# Altium schematic sheet Boost.SchDoc
size A4; SheetNumber: 3; SheetTotal: 4
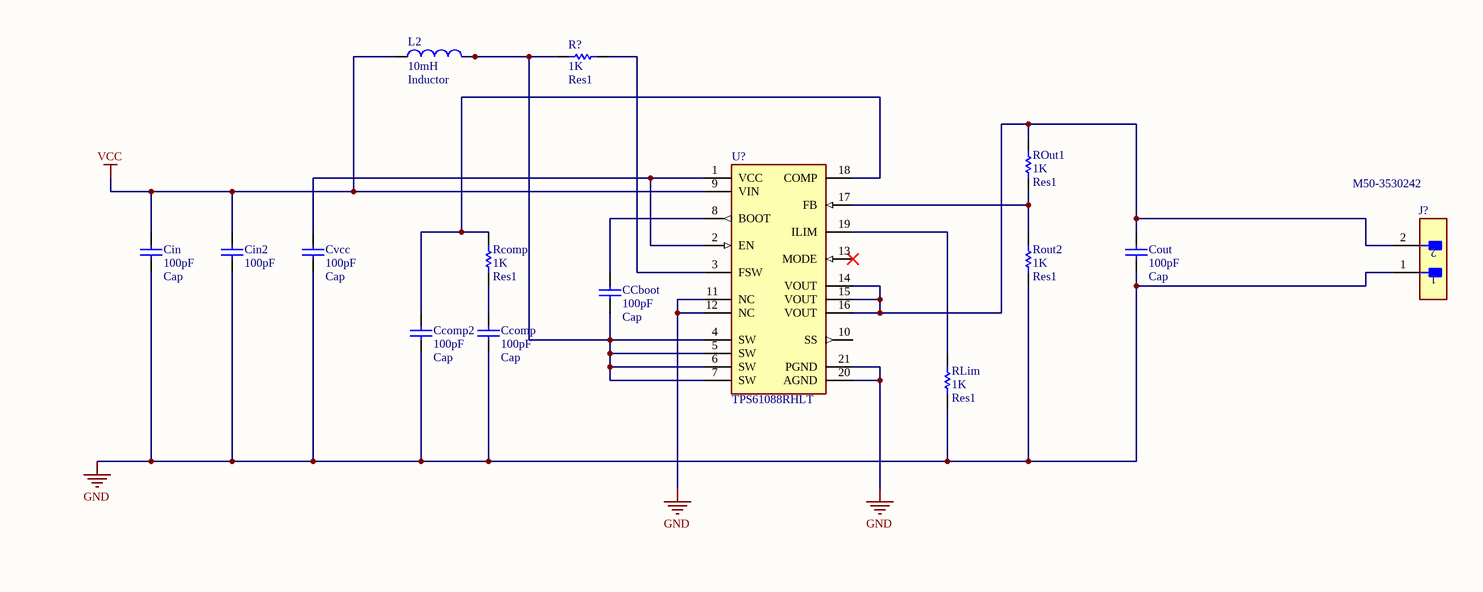
[diagram p0: Boost.SchDoc, right]

## Parts
CCboot  Cap  value 100pF  [RAD-0.3]
Ccomp  Cap  value 100pF  [RAD-0.3]
Ccomp2  Cap  value 100pF  [RAD-0.3]
Cin  Cap  value 100pF  [RAD-0.3]
Cin2  value 100pF  [RAD-0.3]
Cout  Cap  value 100pF  [RAD-0.3]
Cvcc  Cap  value 100pF  [RAD-0.3]
J?  M50-3530242  [FP-M50-3530242-MFG]
L2  Inductor  value 10mH  [0402-A]
R?  Res1  value 1K  [AXIAL-0.3]
Rcomp  Res1  value 1K  [AXIAL-0.3]
RLim  Res1  value 1K  [AXIAL-0.3]
ROut1  Res1  value 1K  [AXIAL-0.3]
Rout2  Res1  value 1K  [AXIAL-0.3]
U?  TPS61088RHLT  [FP-RHL0020A-MFG]

## Nets
GND: Ccomp.1 Ccomp2.1 Cin.1 Cin2.1 Cout.1 Cvcc.1 J?.1 RLim.1 Rout2.1 U?.11(NC) U?.12(NC) U?.20(AGND) U?.21(PGND)
VCC: Cin.2 Cin2.2 L2.1 U?.9(VIN)
NetCCboot_1: CCboot.1 L2.2 R?.2 U?.4(SW) U?.5(SW) U?.6(SW) U?.7(SW)
NetCCboot_2: CCboot.2 U?.8(BOOT)
NetCcomp2_2: Ccomp2.2 Rcomp.2 U?.18(COMP)
NetCcomp_2: Ccomp.2 Rcomp.1
NetCout_2: Cout.2 J?.2 ROut1.2 U?.14(VOUT) U?.15(VOUT) U?.16(VOUT)
NetCvcc_2: Cvcc.2 U?.1(VCC) U?.2(EN)
NetR?_1: R?.1 U?.3(FSW)
NetRLim_2: RLim.2 U?.19(ILIM)
NetROut1_1: ROut1.1 Rout2.2 U?.17(FB)

Not connected (* = marked no-connect by the designer): U? 10(SS) 13(MODE)*

## Library data of the parts
CCboot Ccomp Ccomp2 Cin Cin2 Cout Cvcc = Cap: Capacitor; Published: 8-Jun-2000; LatestRevisionDate: 17-Jul-2002; LatestRevisionNote: Re-released for DXP Platform.; PackageReference: RAD-0.3; Publisher: Altium Limited; PackageDescription: Radial Cap, Thru-Hole; 2 Leads; 0.3 in Pin Spacing
J? = CMP-15831-000040-1: CONN HEADER VERT 2POS 1.27MM
L2 = Inductor: Code_IEC: 1005; Published: 8-Jun-2000; LatestRevisionDate: 29-May-2009; LatestRevisionNote: IPC-7351 Footprint Added.; PackageReference: 0402-A; Publisher: Altium Limited; PackageDescription: Chip Inductor; Code_JEITA: 0402
R? Rcomp RLim ROut1 Rout2 = Res1: Resistor; Published: 8-Jun-2000; LatestRevisionDate: 17-Jul-2002; LatestRevisionNote: Re-released for DXP Platform.; PackageReference: AXIAL-0.3; Publisher: Altium Limited; PackageDescription: Axial Device, Thru-Hole; 2 Leads; 0.3 in Pin Spacing
U? = CMP-04918-000117-1: IC REG BOOST ADJ 10A 20VQFN; Manufacturer: Texas Instruments; Output Voltage: 4.5-12.6V; Max Junction Temp: +125°C; Max Duty Cycle: 90%; Output Type: AdjustableProgrammable; Nominal Supply Current: 1-110uA; Min Supply Voltage: 2.7V; Switching Frequency: 200-2200kHz; Number Of Outputs: 1; Max Supply Voltage: 12V; Manufacturer Part Number: TPS61088RHLT; Digikey Description: IC REG BOOST ADJ 10A 20VQFN; Octopart: https://octopart.com/tps61088rhlt-texas+instruments-57155059; Switching Topology: Boost; Lead Free: Yes; Output Current: 10A; Height: 1mm; Temperature: -40°C to +85°C; Package: RHL0020A; Device Class L3: Voltage Regulators - Switching; RoHS: TRUE; Temperature Range Low: -40°C; Temperature Range High: +85°C; Device Class L1: Integrated Circuits (ICs); Automotive: No; Category: IC; ComponentLink2Description: Datasheet; ComponentLink2URL: http://www.ti.com/lit/ds/symlink/tps61088.pdf; Device Class L2: Power Management ICs